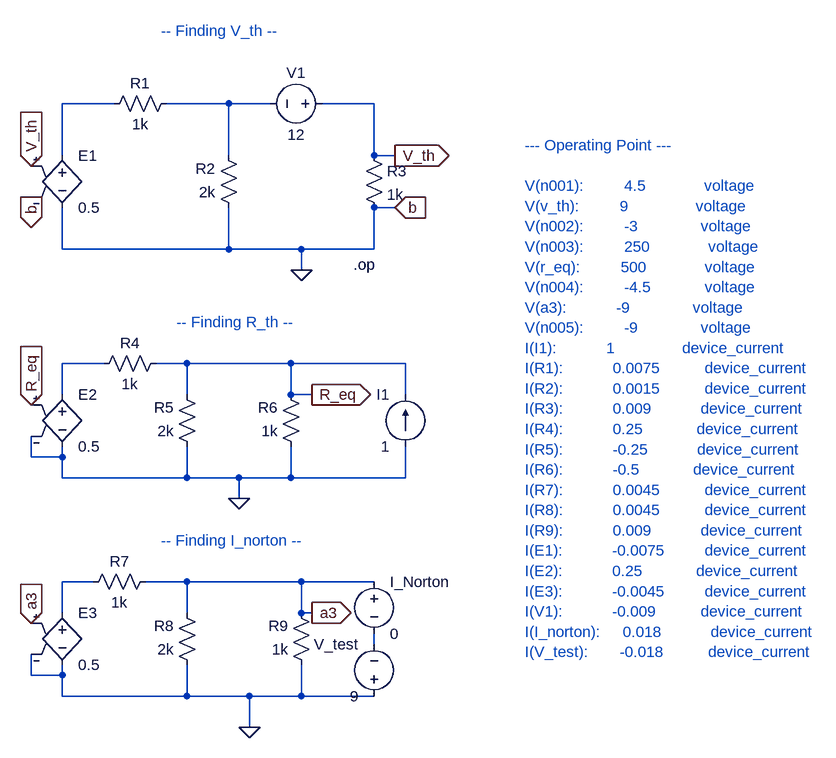
[diagram p0: schematic Q2.asc]
Q2.asc, the LTspice schematic file:
Version 4
SHEET 1 2680 1124
WIRE 128 48 48 48
WIRE 304 48 208 48
WIRE 368 48 304 48
WIRE 528 48 448 48
WIRE 48 128 48 48
WIRE 304 128 304 48
WIRE 528 128 528 48
WIRE 560 128 528 128
WIRE 560 208 528 208
WIRE 48 272 48 208
WIRE 304 272 304 208
WIRE 304 272 48 272
WIRE 416 272 304 272
WIRE 528 272 528 208
WIRE 528 272 416 272
WIRE 416 304 416 272
WIRE 112 448 48 448
WIRE 240 448 192 448
WIRE 400 448 240 448
WIRE 576 448 400 448
WIRE 48 496 48 448
WIRE 240 496 240 448
WIRE 400 496 400 448
WIRE 432 496 400 496
WIRE 576 496 576 448
WIRE 0 592 0 560
WIRE 48 592 48 576
WIRE 48 592 0 592
WIRE 48 624 48 592
WIRE 240 624 240 576
WIRE 240 624 48 624
WIRE 320 624 240 624
WIRE 400 624 400 576
WIRE 400 624 320 624
WIRE 576 624 576 576
WIRE 576 624 400 624
WIRE 320 656 320 624
WIRE 96 784 48 784
WIRE 240 784 176 784
WIRE 416 784 240 784
WIRE 528 784 416 784
WIRE 48 832 48 784
WIRE 240 832 240 784
WIRE 416 832 416 784
WIRE 432 832 416 832
WIRE 528 880 528 864
WIRE 0 928 0 896
WIRE 48 928 48 912
WIRE 48 928 0 928
WIRE 48 960 48 928
WIRE 240 960 240 912
WIRE 240 960 48 960
WIRE 336 960 240 960
WIRE 416 960 416 912
WIRE 416 960 336 960
WIRE 528 960 416 960
WIRE 336 1008 336 960
FLAG 416 304 0
FLAG 560 128 V_th
IOPIN 560 128 Out
FLAG 560 208 b
IOPIN 560 208 In
FLAG 0 144 V_th
IOPIN 0 144 In
FLAG 0 192 b
IOPIN 0 192 Out
FLAG 432 496 R_eq
IOPIN 432 496 Out
FLAG 0 512 R_eq
IOPIN 0 512 In
FLAG 320 656 0
FLAG 336 1008 0
FLAG 432 832 a3
IOPIN 432 832 Out
FLAG 0 848 a3
IOPIN 0 848 In
SYMBOL e 48 112 R0
SYMATTR InstName E1
SYMATTR Value 0.5
SYMBOL res 112 64 R270
WINDOW 0 32 56 VTop 2
WINDOW 3 0 56 VBottom 2
SYMATTR InstName R1
SYMATTR Value 1k
SYMBOL res 320 224 R180
WINDOW 0 36 76 Left 2
WINDOW 3 36 40 Left 2
SYMATTR InstName R2
SYMATTR Value 2k
SYMBOL res 512 112 R0
SYMATTR InstName R3
SYMATTR Value 1k
SYMBOL voltage 464 48 R90
WINDOW 0 -32 56 VBottom 2
WINDOW 3 32 56 VTop 2
SYMATTR InstName V1
SYMATTR Value 12
SYMBOL e 48 480 R0
SYMATTR InstName E2
SYMATTR Value 0.5
SYMBOL res 208 432 R90
WINDOW 0 0 56 VBottom 2
WINDOW 3 32 56 VTop 2
SYMATTR InstName R4
SYMATTR Value 1k
SYMBOL res 256 592 R180
WINDOW 0 36 76 Left 2
WINDOW 3 36 40 Left 2
SYMATTR InstName R5
SYMATTR Value 2k
SYMBOL res 416 592 R180
WINDOW 0 36 76 Left 2
WINDOW 3 36 40 Left 2
SYMATTR InstName R6
SYMATTR Value 1k
SYMBOL current 576 576 R180
WINDOW 0 24 80 Left 2
WINDOW 3 24 0 Left 2
SYMATTR InstName I1
SYMATTR Value 1
SYMBOL e 48 816 R0
SYMATTR InstName E3
SYMATTR Value 0.5
SYMBOL res 80 800 R270
WINDOW 0 32 56 VTop 2
WINDOW 3 0 56 VBottom 2
SYMATTR InstName R7
SYMATTR Value 1k
SYMBOL res 256 928 R180
WINDOW 0 36 76 Left 2
WINDOW 3 36 40 Left 2
SYMATTR InstName R8
SYMATTR Value 2k
SYMBOL res 432 928 R180
WINDOW 0 36 76 Left 2
WINDOW 3 36 40 Left 2
SYMATTR InstName R9
SYMATTR Value 1k
SYMBOL voltage 528 768 R0
SYMATTR InstName I_Norton
SYMATTR Value 0
SYMBOL voltage 528 976 R180
WINDOW 0 24 96 Left 2
WINDOW 3 24 16 Left 2
SYMATTR InstName V_test
SYMATTR Value 9
TEXT 200 -64 Left 2 ;-- Finding V_th --
TEXT 496 296 Left 2 !.op
TEXT 224 384 Left 2 ;-- Finding R_th --
TEXT 200 720 Left 2 ;-- Finding I_norton --
TEXT 760 112 Left 2 ;--- Operating Point ---\n \nV(n001):         4.5             voltage\nV(v_th):         9               voltage\nV(n002):         -3              voltage\nV(n003):         250             voltage\nV(r_eq):         500             voltage\nV(n004):         -4.5            voltage\nV(a3):           -9              voltage\nV(n005):         -9              voltage\nI(I1):           1               device_current\nI(R1):           0.0075          device_current\nI(R2):           0.0015          device_current\nI(R3):           0.009           device_current\nI(R4):           0.25            device_current\nI(R5):           -0.25           device_current\nI(R6):           -0.5            device_current\nI(R7):           0.0045          device_current\nI(R8):           0.0045          device_current\nI(R9):           0.009           device_current\nI(E1):           -0.0075         device_current\nI(E2):           0.25            device_current\nI(E3):           -0.0045         device_current\nI(V1):           -0.009          device_current\nI(I_norton):     0.018           device_current\nI(V_test):       -0.018          device_current

The netlist it stands for:
* Q2.asc
E1 N001 0 V_th 0 0.5
R1 N001 N002 1k
R2 0 N002 2k
R3 V_th 0 1k
V1 V_th N002 12
E2 N003 0 R_eq 0 0.5
R4 R_eq N003 1k
R5 0 R_eq 2k
R6 0 R_eq 1k
I1 0 R_eq 1
E3 N004 0 a3 0 0.5
R7 N004 a3 1k
R8 0 a3 2k
R9 0 a3 1k
V§I_Norton a3 N005 0
V_test 0 N005 9
* -- Finding V_th --
.op
* -- Finding R_th --
* -- Finding I_norton --
* --- Operating Point ---
* V(n001):         4.5             voltage
* V(v_th):         9               voltage
* V(n002):         -3              voltage
* V(n003):         250             voltage
* V(r_eq):         500             voltage
* V(n004):         -4.5            voltage
* V(a3):           -9              voltage
* V(n005):         -9              voltage
* I(I1):           1               device_current
* I(R1):           0.0075          device_current
* I(R2):           0.0015          device_current
* I(R3):           0.009           device_current
* I(R4):           0.25            device_current
* I(R5):           -0.25           device_current
* I(R6):           -0.5            device_current
* I(R7):           0.0045          device_current
* I(R8):           0.0045          device_current
* I(R9):           0.009           device_current
* I(E1):           -0.0075         device_current
* I(E2):           0.25            device_current
* I(E3):           -0.0045         device_current
* I(V1):           -0.009          device_current
* I(I_norton):     0.018           device_current
* I(V_test):       -0.018          device_current
.backanno
.end